# Altium schematic sheet Connectors.SchDoc
size A3; SheetNumber: 5; SheetTotal: 5
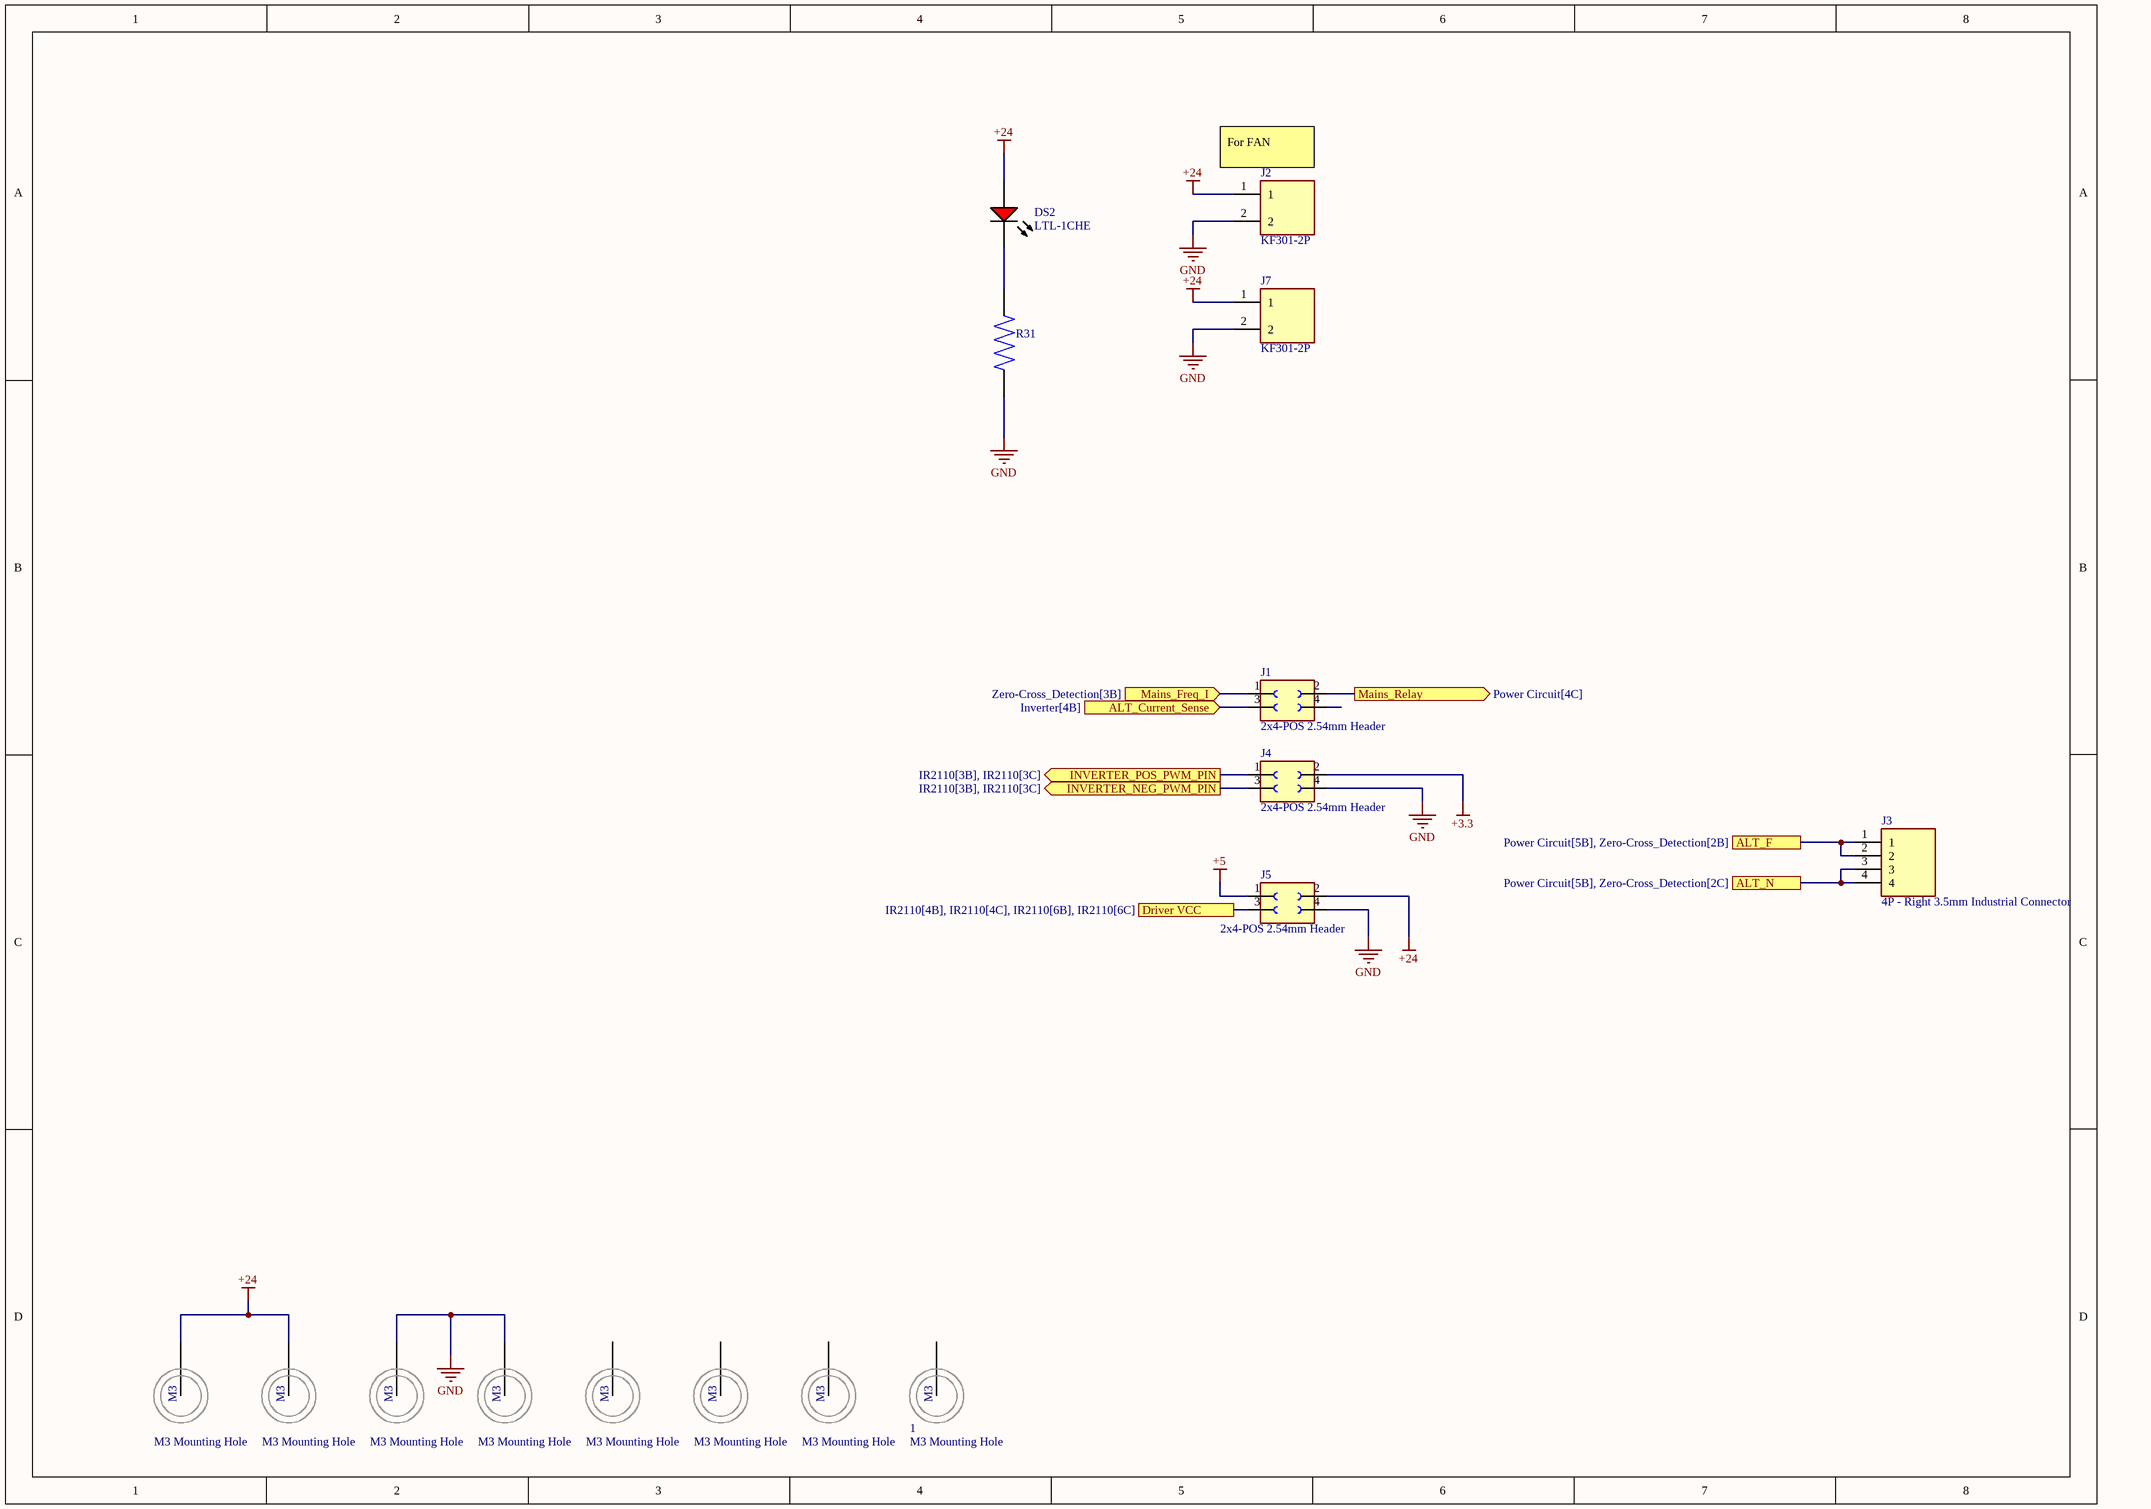
[diagram p0: Connectors.SchDoc]

## Parts
(Parts that share a designator on the sheet are numbered #1, #2 ... from top to bottom, then left to right.)
1  M3 Mounting Hole  [M3 - Mounting Hole]
?#1  M3 Mounting Hole  [M3 - Mounting Hole]
?#2  M3 Mounting Hole  [M3 - Mounting Hole]
?#3  M3 Mounting Hole  [M3 - Mounting Hole]
?#4  M3 Mounting Hole  [M3 - Mounting Hole]
?#5  M3 Mounting Hole  [M3 - Mounting Hole]
?#6  M3 Mounting Hole  [M3 - Mounting Hole]
?#7  M3 Mounting Hole  [M3 - Mounting Hole]
DS2  LTL-1CHE  [LED3mm]
J1  2x4-POS 2.54mm Header  [2x4-POS 2.54mm Header]
J2  KF301-2P  [KF301-2P]
J3  4P - Right 3.5mm Industrial Connector  [4P - Right 3.5mm Industrial Connector]
J4  2x4-POS 2.54mm Header  [2x4-POS 2.54mm Header]
J5  2x4-POS 2.54mm Header  [2x4-POS 2.54mm Header]
J7  KF301-2P  [KF301-2P]
R31  Resistor_Through Hole  [Resistor_Through Hole]  (value not drawn)

## Ports
ALT_Current_Sense (in, see Inverter[4B]), ALT_F (see Power Circuit[5B], Zero-Cross_Detection[2B]), ALT_N (see Power Circuit[5B], Zero-Cross_Detection[2C]), Driver VCC (see IR2110[4B], IR2110[4C], IR2110[6B], IR2110[6C]), INVERTER_NEG_PWM_PIN (out, see IR2110[3B], IR2110[3C]), INVERTER_POS_PWM_PIN (out, see IR2110[3B], IR2110[3C]), Mains_Freq_I (in, see Zero-Cross_Detection[3B]), Mains_Relay (out, see Power Circuit[4C])

## Nets
+3.3: J4.2
+5: J5.1
+24: ?#1.1(M3) ?#2.1(M3) DS2.1(A) J2.1 J5.2 J7.1
GND: ?#3.1(M3) ?#4.1(M3) J2.2 J4.4 J5.4 J7.2 R31.2
ALT_Current_Sense: J1.3 ; port ALT_Current_Sense
ALT_F: J3.1 J3.2 ; port ALT_F
ALT_N: J3.3 J3.4 ; port ALT_N
Driver VCC: J5.3 ; port Driver VCC
INVERTER_NEG_PWM_PIN: J4.3 ; port INVERTER_NEG_PWM_PIN
INVERTER_POS_PWM_PIN: J4.1 ; port INVERTER_POS_PWM_PIN
Mains_Freq_I: J1.1 ; port Mains_Freq_I
Mains_Relay: J1.2 ; port Mains_Relay
NetDS2_2: DS2.2(K) R31.1

Not connected (* = marked no-connect by the designer): 1 1(M3); ?#5 1(M3); ?#6 1(M3); ?#7 1(M3); J1 4(3)

## Notes on the sheet
- (near J2) For FAN

## Library data of the parts
DS2 = RED_LED 3mm: Radial LED, 12.6 mcd, 20 mA, 2 V, -55 to 100 degC, 2-Pin THD, RoHS, Bulk; Shielding: Unshielded; Resistance: 0.045 Ohm; Current Rating: 3.6 A; Tolerance: 20%; PackageReference: LTL-1CHE; PackageDescription: 2-Pin Through Hole Device, Dia 3.8 mm, Pitch 2.54 mm; Case\Package: Radial; Length: 0.97 inch; Width: 0.62 inch; Height: 1.1 inch; Radiation Hardening: No; Lead Pitch: 11.44 mm; ComponentLink1URL: http://www.us.liteon.com/; ComponentLink1Description: Manufacturer URL; RoHSCompliant: true; Packaging: Tray; Mount: Through Hole; Min Operating Temperature: -40 degC; Max Operating Temperature: 130 degC; ComponentLink2URL: https://datasheet.ciiva.com/15117/getdatasheetpartid-187746-15117985.pdf; Package Quantity: 55; ComponentLink2Description: Datasheet; DatasheetVersion: Dec-03
J1 J4 J5 = 2x4-POS 2.54mm Header: Female header [WÃ¼rth Elektronik] 613004243121 Female header; SnapEDA_Link: https://www.snapeda.com/parts/613004243121/W%C3%BCrth%20Elektronik/view-part/1737074/?ref=snap; Check_prices: https://www.snapeda.com/parts/613004243121/W%C3%BCrth%20Elektronik/view-part/1737074/?ref=eda; Availability: Unavailable; Value: *; MF: WÃ¼rth Elektronik; Price: None; MP: 613004243121; Package: None
J2 J7 = KF301-2P: 2 Pin Terminal Block 5mm Pitch; Price: None; Value: *; MP: KF301-2P; Package: None; Availability: Unavailable
J3 = 4P - Right 3.5mm Industrial Connector: MP: 5-146290-4; Package: None; Price: None; Value: *; Availability: Unavailable
R31 = Resistor_Through Hole: 1.02 Ohms Â±1% 0.25W, 1/4W Through Hole Resistor Axial Metal Film; MP: MFR-25FTE52-1R; MF: Yageo; Availability: Warning; Value: *; Check_prices: https://www.snapeda.com/parts/MFR-25FTE52-1R/Yageo/view-part/4629919/?ref=eda; Package: Axial Yageo; Price: None; SnapEDA_Link: https://www.snapeda.com/parts/MFR-25FTE52-1R/Yageo/view-part/4629919/?ref=snap; Purchase-URL: https://pricing.snapeda.com/search/part/MFR-25FTE52-1R/?ref=eda